# EAGLE design ModSynth_PCB (EAGLE 9.6.2)
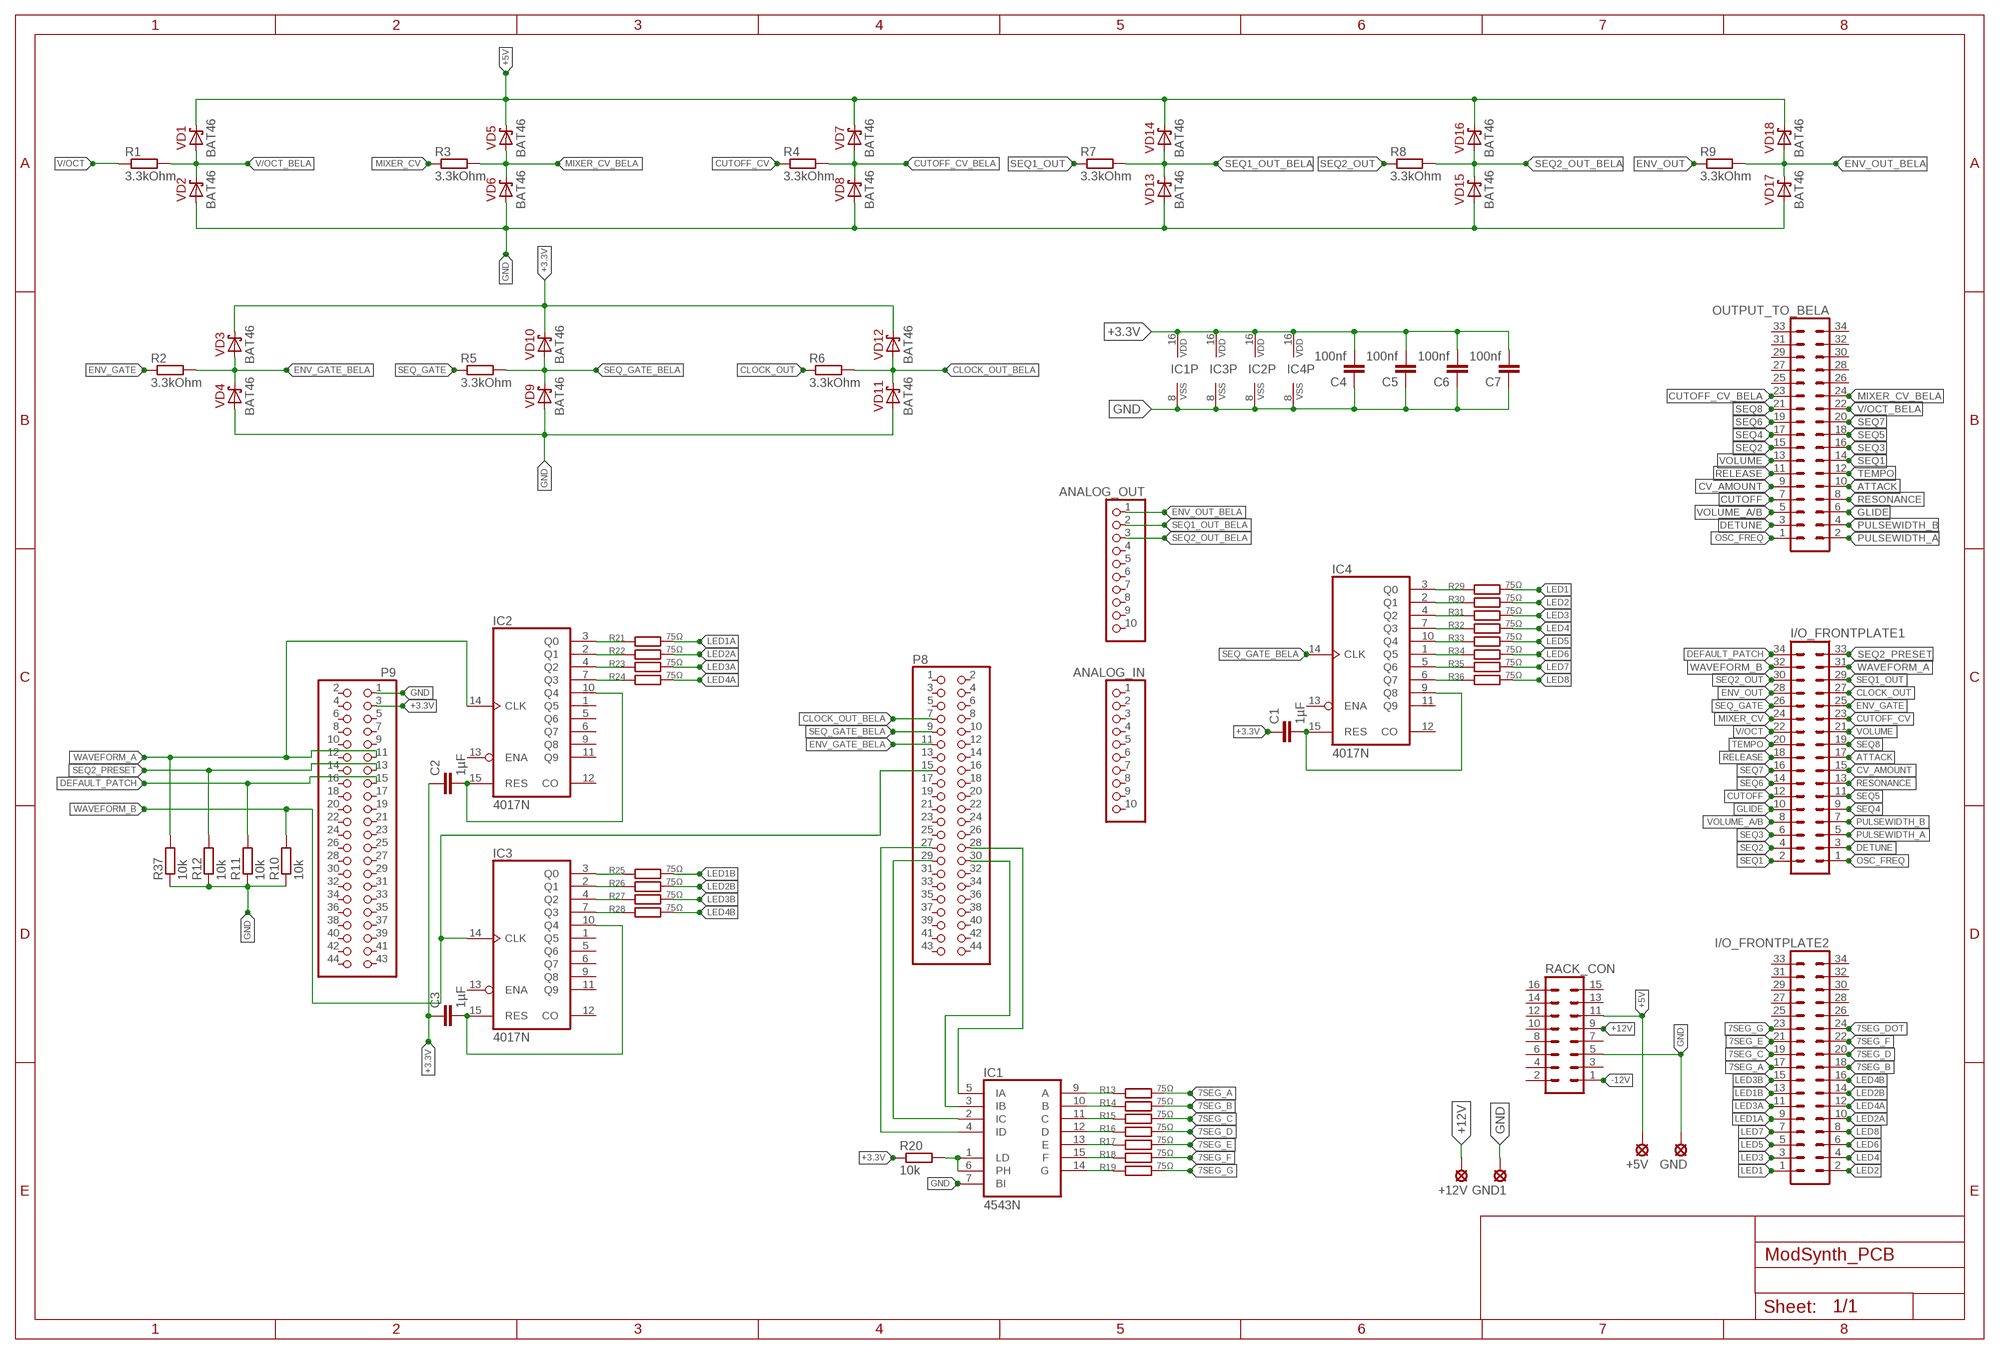
[diagram p0: schematic, sheet 1]

## Parts
+5V  LSP10  [LSP10]
+12V  LSP10  [LSP10]
ANALOG_IN  PINHD-1X10  [1X10]
ANALOG_OUT  PINHD-1X10  [1X10]
C1  1µF  C-EU025-025X050  [C025-025X050]
C2  1µF  C-EU025-025X050  [C025-025X050]
C3  1µF  C-EU025-025X050  [C025-025X050]
C4  100nf  C-EU025-025X050  [C025-025X050]
C5  100nf  C-EU025-025X050  [C025-025X050]
C6  100nf  C-EU025-025X050  [C025-025X050]
C7  100nf  C-EU025-025X050  [C025-025X050]
GND  LSP10  [LSP10]
GND1  LSP10  [LSP10]
I/O_FRONTPLATE1  ML34  [ML34]
I/O_FRONTPLATE2  ML34  [ML34]
IC1  4543N  [DIL16]
IC2  4017N  [DIL16]
IC3  4017N  [DIL16]
IC4  4017N  [DIL16]
OUTPUT_TO_BELA  ML34  [ML34]
P8  PINHD-2X22  [2X22]
P9  PINHD-2X22  [2X22]
R1  3.3kOhm  R-EU_0204/7  [0204/7]
R2  3.3kOhm  R-EU_0204/7  [0204/7]
R3  3.3kOhm  R-EU_0204/7  [0204/7]
R4  3.3kOhm  R-EU_0204/7  [0204/7]
R5  3.3kOhm  R-EU_0204/7  [0204/7]
R6  3.3kOhm  R-EU_0204/7  [0204/7]
R7  3.3kOhm  R-EU_0204/7  [0204/7]
R8  3.3kOhm  R-EU_0204/7  [0204/7]
R9  3.3kOhm  R-EU_0204/7  [0204/7]
R10  10k  R-EU_0204/7  [0204/7]
R11  10k  R-EU_0204/7  [0204/7]
R12  10k  R-EU_0204/7  [0204/7]
R13  75Ω  R-EU_0204/7  [0204/7]
R14  75Ω  R-EU_0204/7  [0204/7]
R15  75Ω  R-EU_0204/7  [0204/7]
R16  75Ω  R-EU_0204/7  [0204/7]
R17  75Ω  R-EU_0204/7  [0204/7]
R18  75Ω  R-EU_0204/7  [0204/7]
R19  75Ω  R-EU_0204/7  [0204/7]
R20  10k  R-EU_0204/7  [0204/7]
R21  75Ω  R-EU_0204/7  [0204/7]
R22  75Ω  R-EU_0204/7  [0204/7]
R23  75Ω  R-EU_0204/7  [0204/7]
R24  75Ω  R-EU_0204/7  [0204/7]
R25  75Ω  R-EU_0204/7  [0204/7]
R26  75Ω  R-EU_0204/7  [0204/7]
R27  75Ω  R-EU_0204/7  [0204/7]
R28  75Ω  R-EU_0204/7  [0204/7]
R29  75Ω  R-EU_0204/7  [0204/7]
R30  75Ω  R-EU_0204/7  [0204/7]
R31  75Ω  R-EU_0204/7  [0204/7]
R32  75Ω  R-EU_0204/7  [0204/7]
R33  75Ω  R-EU_0204/7  [0204/7]
R34  75Ω  R-EU_0204/7  [0204/7]
R35  75Ω  R-EU_0204/7  [0204/7]
R36  75Ω  R-EU_0204/7  [0204/7]
R37  10k  R-EU_0204/7  [0204/7]
RACK_CON  ML16  [ML16]
VD1  BAT46  [DO35-7]
VD2  BAT46  [DO35-7]
VD3  BAT46  [DO35-7]
VD4  BAT46  [DO35-7]
VD5  BAT46  [DO35-7]
VD6  BAT46  [DO35-7]
VD7  BAT46  [DO35-7]
VD8  BAT46  [DO35-7]
VD9  BAT46  [DO35-7]
VD10  BAT46  [DO35-7]
VD11  BAT46  [DO35-7]
VD12  BAT46  [DO35-7]
VD13  BAT46  [DO35-7]
VD14  BAT46  [DO35-7]
VD15  BAT46  [DO35-7]
VD16  BAT46  [DO35-7]
VD17  BAT46  [DO35-7]
VD18  BAT46  [DO35-7]

## Nets
7SEG_A: I/O_FRONTPLATE2.17 R13.2
7SEG_B: I/O_FRONTPLATE2.18 R14.2
7SEG_C: I/O_FRONTPLATE2.19 R15.2
7SEG_D: I/O_FRONTPLATE2.20 R16.2
7SEG_DOT: I/O_FRONTPLATE2.24
7SEG_E: I/O_FRONTPLATE2.21 R17.2
7SEG_F: I/O_FRONTPLATE2.22 R18.2
7SEG_G: I/O_FRONTPLATE2.23 R19.2
+3.3V: C1.1 C2.1 C3.1 C4.2 C5.2 C6.2 C7.2 IC1.16(VDD) IC2.16(VDD) IC3.16(VDD) IC4.16(VDD) P9.3 R20.1 VD3.C VD10.C VD12.C
+5V: +5V.MP RACK_CON.11 VD1.C VD5.C VD7.C VD14.C VD16.C VD18.C
+12V: +12V.MP RACK_CON.9
-12V: RACK_CON.1
ATTACK: I/O_FRONTPLATE1.17 OUTPUT_TO_BELA.10
CLOCK_OUT: I/O_FRONTPLATE1.27 R6.1
CLOCK_OUT_BELA: P8.7 R6.2 VD11.C VD12.A
CUTOFF: I/O_FRONTPLATE1.12 OUTPUT_TO_BELA.7
CUTOFF_CV: I/O_FRONTPLATE1.23 R4.1
CUTOFF_CV_BELA: OUTPUT_TO_BELA.23 R4.2 VD7.A VD8.C
CV_AMOUNT: I/O_FRONTPLATE1.15 OUTPUT_TO_BELA.9
DEFAULT_PATCH: I/O_FRONTPLATE1.34 P9.15 R11.2
DETUNE: I/O_FRONTPLATE1.3 OUTPUT_TO_BELA.3
ENV_GATE: I/O_FRONTPLATE1.25 R2.1
ENV_GATE_BELA: P8.11 R2.2 VD3.A VD4.C
ENV_OUT: I/O_FRONTPLATE1.28 R9.1
ENV_OUT_BELA: ANALOG_OUT.1 R9.2 VD17.C VD18.A
GLIDE: I/O_FRONTPLATE1.10 OUTPUT_TO_BELA.6
GND: C4.1 C5.1 C6.1 C7.1 GND1.MP GND.MP IC1.7(BI) IC1.8(VSS) IC2.8(VSS) IC3.8(VSS) IC4.8(VSS) P9.1 R10.1 R11.1 R12.1 R37.1 RACK_CON.5 VD2.A VD4.A VD6.A VD8.A VD9.A VD11.A VD13.A VD15.A VD17.A
LED1: I/O_FRONTPLATE2.1 R29.2
LED1A: I/O_FRONTPLATE2.9 R21.2
LED1B: I/O_FRONTPLATE2.13 R25.2
LED2: I/O_FRONTPLATE2.2 R30.2
LED2A: I/O_FRONTPLATE2.10 R22.2
LED2B: I/O_FRONTPLATE2.14 R26.2
LED3: I/O_FRONTPLATE2.3 R31.2
LED3A: I/O_FRONTPLATE2.11 R23.2
LED3B: I/O_FRONTPLATE2.15 R27.2
LED4: I/O_FRONTPLATE2.4 R32.2
LED4A: I/O_FRONTPLATE2.12 R24.2
LED4B: I/O_FRONTPLATE2.16 R28.2
LED5: I/O_FRONTPLATE2.5 R33.2
LED6: I/O_FRONTPLATE2.6 R34.2
LED7: I/O_FRONTPLATE2.7 R35.2
LED8: I/O_FRONTPLATE2.8 R36.2
MIXER_CV: I/O_FRONTPLATE1.24 R3.1
MIXER_CV_BELA: OUTPUT_TO_BELA.24 R3.2 VD5.A VD6.C
N$1: IC1.9(A) R13.1
N$2: IC1.10(B) R14.1
N$3: IC1.11(C) R15.1
N$4: IC1.12(D) R16.1
N$5: IC1.13(E) R17.1
N$6: IC1.15(F) R18.1
N$7: IC1.14(G) R19.1
N$8: IC1.1(LD) IC1.6(PH) R20.2
N$15: C2.2 IC2.10(Q4) IC2.15(RES)
N$16: IC2.3(Q0) R21.1
N$17: IC2.2(Q1) R22.1
N$18: IC2.4(Q2) R23.1
N$19: IC2.7(Q3) R24.1
N$24: C3.2 IC3.10(Q4) IC3.15(RES)
N$25: IC3.3(Q0) R25.1
N$26: IC3.2(Q1) R26.1
N$27: IC3.4(Q2) R27.1
N$28: IC3.7(Q3) R28.1
N$33: C1.2 IC4.9(Q8) IC4.15(RES)
N$34: IC4.3(Q0) R29.1
N$35: IC4.2(Q1) R30.1
N$36: IC4.4(Q2) R31.1
N$37: IC4.7(Q3) R32.1
N$39: IC4.10(Q4) R33.1
N$40: IC4.1(Q5) R34.1
N$41: IC4.5(Q6) R35.1
N$42: IC4.6(Q7) R36.1
N$50: IC1.4(ID) P8.27
N$51: IC1.5(IA) P8.28
N$52: IC1.3(IB) P8.30
N$53: IC1.2(IC) P8.29
OSC_FREQ: I/O_FRONTPLATE1.1 OUTPUT_TO_BELA.1
PULSEWIDTH_A: I/O_FRONTPLATE1.5 OUTPUT_TO_BELA.2
PULSEWIDTH_B: I/O_FRONTPLATE1.7 OUTPUT_TO_BELA.4
RELEASE: I/O_FRONTPLATE1.18 OUTPUT_TO_BELA.11
RESONANCE: I/O_FRONTPLATE1.13 OUTPUT_TO_BELA.8
SEQ1: I/O_FRONTPLATE1.2 OUTPUT_TO_BELA.14
SEQ1_OUT: I/O_FRONTPLATE1.29 R7.1
SEQ1_OUT_BELA: ANALOG_OUT.2 R7.2 VD13.C VD14.A
SEQ2: I/O_FRONTPLATE1.4 OUTPUT_TO_BELA.15
SEQ2_OUT: I/O_FRONTPLATE1.30 R8.1
SEQ2_OUT_BELA: ANALOG_OUT.3 R8.2 VD15.C VD16.A
SEQ2_PRESET: I/O_FRONTPLATE1.33 P9.13 R12.2
SEQ3: I/O_FRONTPLATE1.6 OUTPUT_TO_BELA.16
SEQ4: I/O_FRONTPLATE1.9 OUTPUT_TO_BELA.17
SEQ5: I/O_FRONTPLATE1.11 OUTPUT_TO_BELA.18
SEQ6: I/O_FRONTPLATE1.14 OUTPUT_TO_BELA.19
SEQ7: I/O_FRONTPLATE1.16 OUTPUT_TO_BELA.20
SEQ8: I/O_FRONTPLATE1.19 OUTPUT_TO_BELA.21
SEQ_GATE: I/O_FRONTPLATE1.26 R5.1
SEQ_GATE_BELA: IC4.14(CLK) P8.9 R5.2 VD9.C VD10.A
TEMPO: I/O_FRONTPLATE1.20 OUTPUT_TO_BELA.12
V/OCT: I/O_FRONTPLATE1.22 R1.1
V/OCT_BELA: OUTPUT_TO_BELA.22 R1.2 VD1.A VD2.C
VOLUME: I/O_FRONTPLATE1.21 OUTPUT_TO_BELA.13
VOLUME_A/B: I/O_FRONTPLATE1.8 OUTPUT_TO_BELA.5
WAVEFORM_A: I/O_FRONTPLATE1.31 IC2.14(CLK) P9.11 R37.2
WAVEFORM_B: I/O_FRONTPLATE1.32 IC3.14(CLK) P8.15 R10.2
Unconnected: ANALOG_IN.1 ANALOG_IN.2 ANALOG_IN.3 ANALOG_IN.4 ANALOG_IN.5 ANALOG_IN.6 ANALOG_IN.7 ANALOG_IN.8 ANALOG_IN.9 ANALOG_IN.10 ANALOG_OUT.4 ANALOG_OUT.5 ANALOG_OUT.6 ANALOG_OUT.7 ANALOG_OUT.8 ANALOG_OUT.9 ANALOG_OUT.10 I/O_FRONTPLATE2.25 I/O_FRONTPLATE2.26 I/O_FRONTPLATE2.27 I/O_FRONTPLATE2.28 I/O_FRONTPLATE2.29 I/O_FRONTPLATE2.30 I/O_FRONTPLATE2.31 I/O_FRONTPLATE2.32 I/O_FRONTPLATE2.33 I/O_FRONTPLATE2.34 IC2.1(Q5) IC2.5(Q6) IC2.6(Q7) IC2.9(Q8) IC2.11(Q9) IC2.12(CO) IC2.13(ENA) IC3.1(Q5) IC3.5(Q6) IC3.6(Q7) IC3.9(Q8) IC3.11(Q9) IC3.12(CO) IC3.13(ENA) IC4.11(Q9) IC4.12(CO) IC4.13(ENA) OUTPUT_TO_BELA.25 OUTPUT_TO_BELA.26 OUTPUT_TO_BELA.27 OUTPUT_TO_BELA.28 OUTPUT_TO_BELA.29 OUTPUT_TO_BELA.30 OUTPUT_TO_BELA.31 OUTPUT_TO_BELA.32 OUTPUT_TO_BELA.33 OUTPUT_TO_BELA.34 P8.1 P8.2 P8.3 P8.4 P8.5 P8.6 P8.8 P8.10 P8.12 P8.13 P8.14 P8.16 P8.17 P8.18 P8.19 P8.20 P8.21 P8.22 P8.23 P8.24 P8.25 P8.26 P8.31 P8.32 P8.33 P8.34 P8.35 P8.36 P8.37 P8.38 P8.39 P8.40 P8.41 P8.42 P8.43 P8.44 P9.2 P9.4 P9.5 P9.6 P9.7 P9.8 P9.9 P9.10 P9.12 P9.14 P9.16 P9.17 P9.18 P9.19 P9.20 P9.21 P9.22 P9.23 P9.24 P9.25 P9.26 P9.27 P9.28 P9.29 P9.30 P9.31 P9.32 P9.33 P9.34 P9.35 P9.36 P9.37 P9.38 P9.39 P9.40 P9.41 P9.42 P9.43 P9.44 RACK_CON.2 RACK_CON.3 RACK_CON.4 RACK_CON.6 RACK_CON.7 RACK_CON.8 RACK_CON.10 RACK_CON.12 RACK_CON.13 RACK_CON.14 RACK_CON.15 RACK_CON.16

## Library data of the parts
+5V +12V GND GND1 = solpad:LSP10: SOLDER PAD drill 1.0 mm, distributor Buerklin, 12H555
ANALOG_IN ANALOG_OUT = pinhead:PINHD-1X10: PIN HEADER
C1-C7 = rcl:C-EU: CAPACITOR, European symbol; SPICEPREFIX: C
I/O_FRONTPLATE1 I/O_FRONTPLATE2 OUTPUT_TO_BELA = con-harting-ml:ML34: HARTING; OC_FARNELL: unknown; OC_NEWARK: unknown
IC1 = 45xx:4543: BCD to 7-segment LCD DECODER
IC2-IC4 = 40xx:4017: COUNTER/DIVIDER
P8 P9 = pinhead:PINHD-2X22: PIN HEADER
R1-R37 = rcl:R-EU_: RESISTOR, European symbol; SPICEPREFIX: R
RACK_CON = con-harting-ml:ML16: HARTING; OC_FARNELL: unknown; OC_NEWARK: unknown
VD1-VD18 = diodes-schottky:?; MOUSER: 511-BAT46

## Board
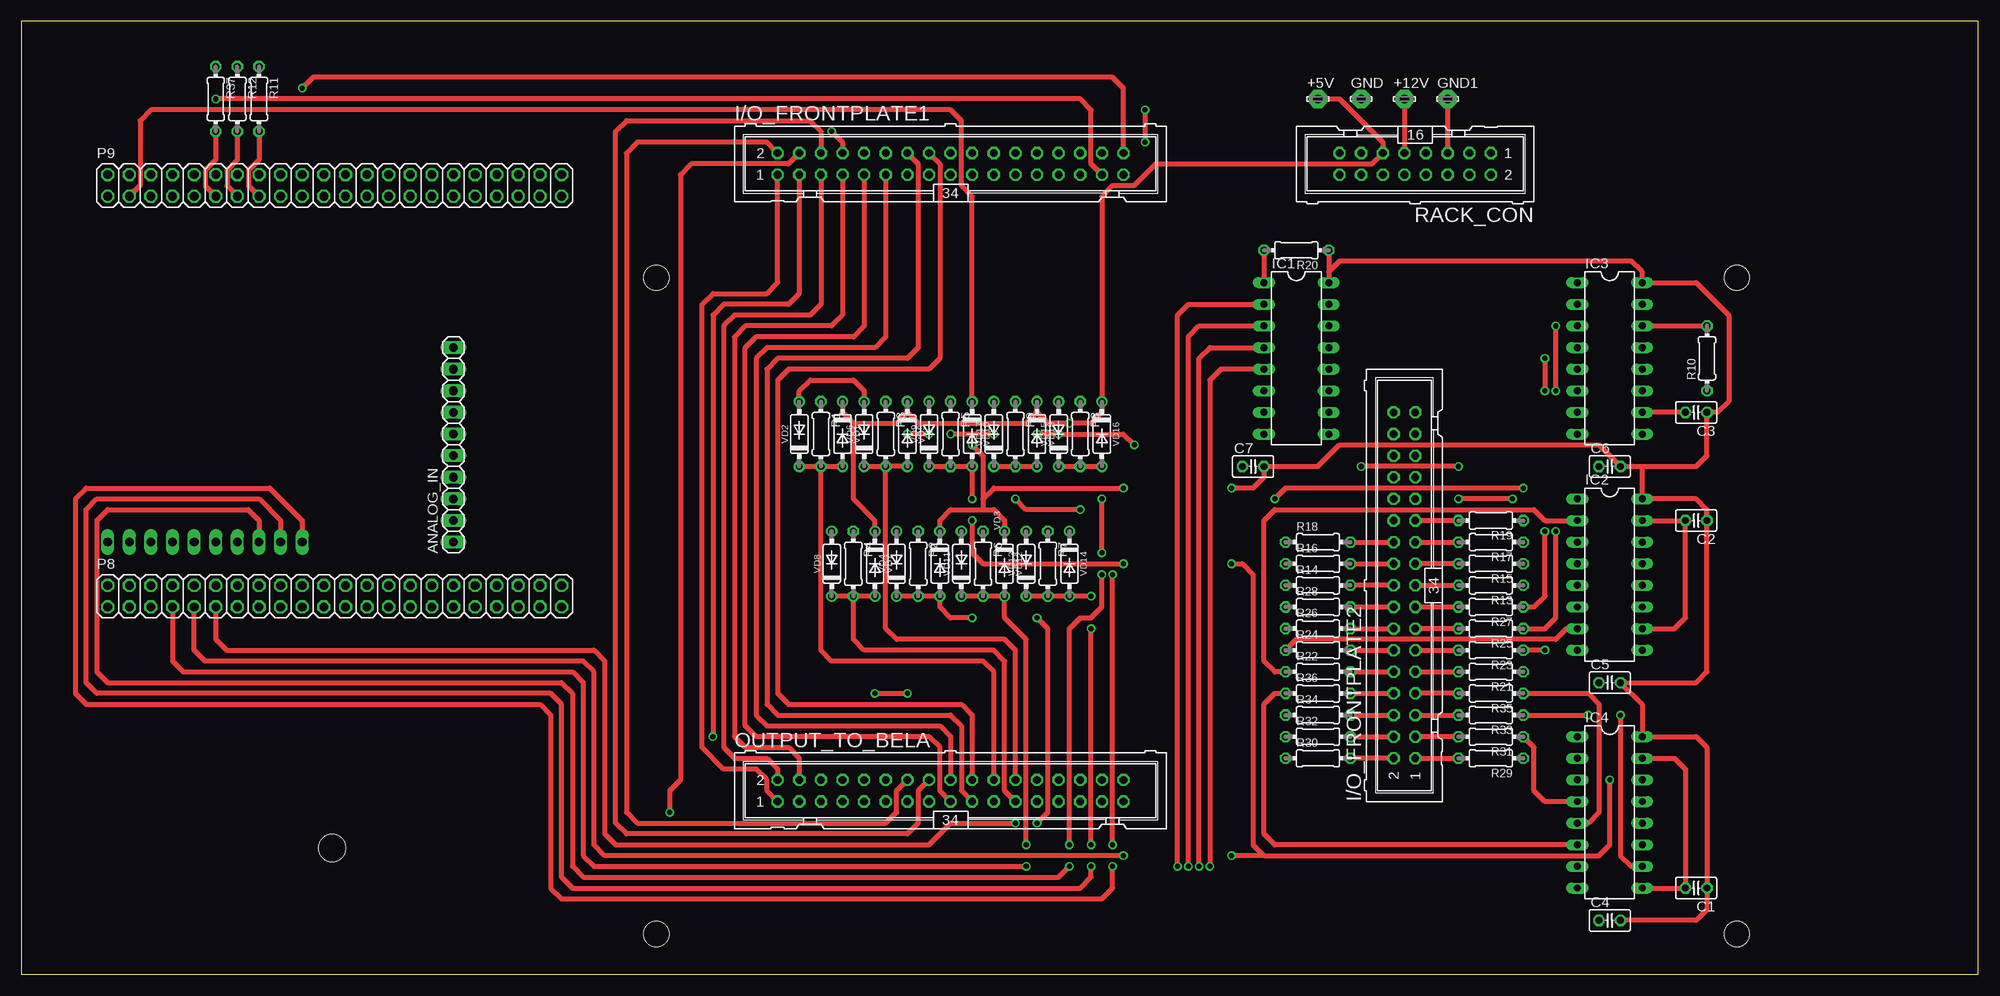
[diagram p1: board, top side]
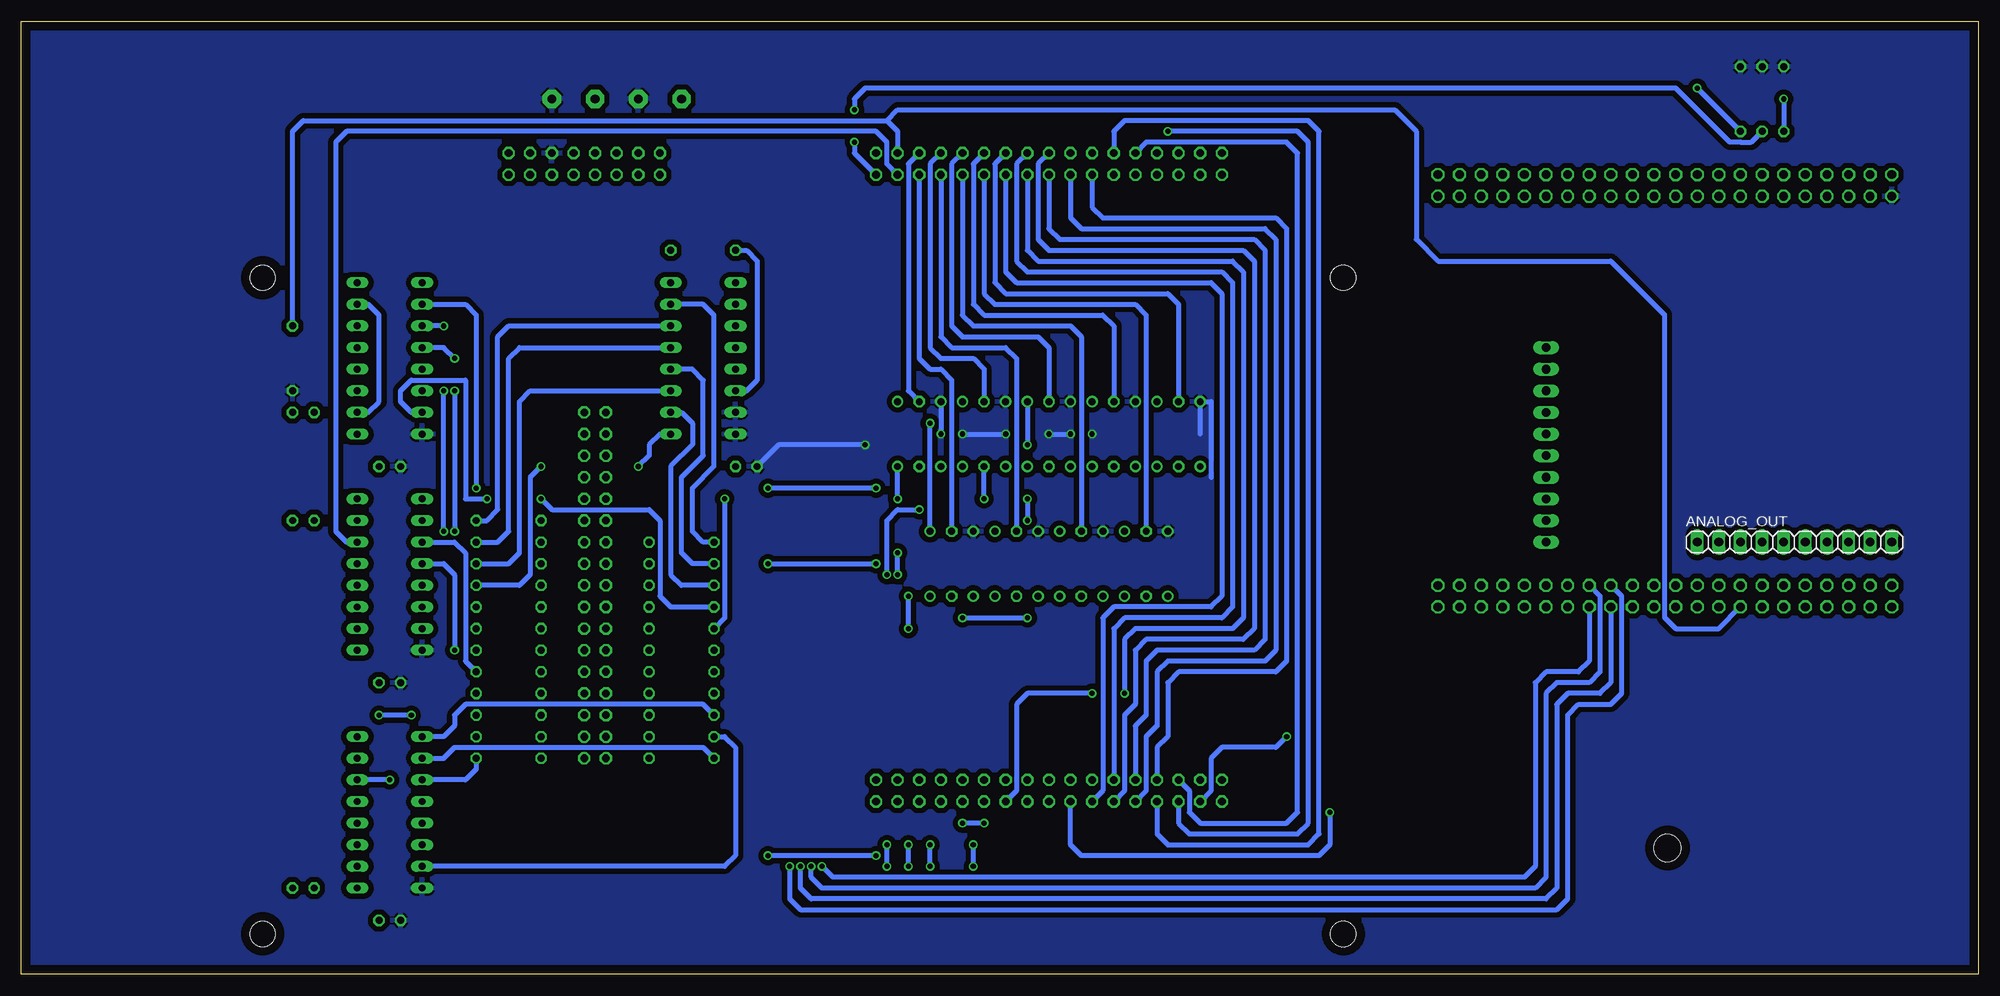
[diagram p2: board, bottom side, seen from below]

Size 230 x 112 mm. Coordinates in mm from the lower left corner, seen from the top.
Outline: 0,0 230,0 230,112 0,112 0,0
Copper layers (1*16): Top 0.035mm / dielectric 1.5mm / Bottom 0.035mm
Design rules "default": minimum track width 6mil, minimum drill 0.35mm, track to track 6mil, track to pad 6mil, pad to pad 6mil, via to via 6mil, smd to smd 6mil, copper to edge 40mil, drill to drill 6mil, minimum pad ring 10mil, minimum via ring 8mil, stop-mask expansion 4mil, vias tented up to drill 0mil, thermal gap 10mil
Holes 3 mm at 74.62,81.87 201.62,81.87 74.62,4.77 201.62,4.77
Holes 3.2 mm at 36.52,14.86

### Footprints (pad centres in the part's own frame; a part is rotated, then mirrored left to right if it is on the bottom)
LSP10 = drill 1.016 pad 2.159 octagon: MP 0,0
1X10 = drill 1.016 long: 1 -11.43,0; 2 -8.89,0; 3 -6.35,0; 4 -3.81,0; 5 -1.27,0; 6 1.27,0; 7 3.81,0; 8 6.35,0; 9 8.89,0; 10 11.43,0
C025-025X050 = drill 0.813 octagon: 1 -1.27,0; 2 1.27,0
ML34 = drill 0.914 octagon: 1 -20.32,-1.27; 2 -20.32,1.27; 3 -17.78,-1.27; 4 -17.78,1.27; 5 -15.24,-1.27; 6 -15.24,1.27; 7 -12.7,-1.27; 8 -12.7,1.27; 9 -10.16,-1.27; 10 -10.16,1.27; 11 -7.62,-1.27; 12 -7.62,1.27; 13 -5.08,-1.27; 14 -5.08,1.27; 15 -2.54,-1.27; 16 -2.54,1.27; 17 0,-1.27; 18 0,1.27; 19 2.54,-1.27; 20 2.54,1.27; 21 5.08,-1.27; 22 5.08,1.27; 23 7.62,-1.27; 24 7.62,1.27; 25 10.16,-1.27; 26 10.16,1.27; 27 12.7,-1.27; 28 12.7,1.27; 29 15.24,-1.27; 30 15.24,1.27; 31 17.78,-1.27; 32 17.78,1.27; 33 20.32,-1.27; 34 20.32,1.27
DIL16 = drill 0.813 long: 1 -8.89,-3.81; 2 -6.35,-3.81; 3 -3.81,-3.81; 4 -1.27,-3.81; 5 1.27,-3.81; 6 3.81,-3.81; 7 6.35,-3.81; 8 8.89,-3.81; 9 8.89,3.81; 10 6.35,3.81; 11 3.81,3.81; 12 1.27,3.81; 13 -1.27,3.81; 14 -3.81,3.81; 15 -6.35,3.81; 16 -8.89,3.81
2X22 = drill 1.016 octagon: 1 -25.4,-1.27; 2 -25.4,1.27; 3 -22.86,-1.27; 4 -22.86,1.27; 5 -20.32,-1.27; 6 -20.32,1.27; 7 -17.78,-1.27; 8 -17.78,1.27; 9 -15.24,-1.27; 10 -15.24,1.27; 11 -12.7,-1.27; 12 -12.7,1.27; 13 -10.16,-1.27; 14 -10.16,1.27; 15 -7.62,-1.27; 16 -7.62,1.27; 17 -5.08,-1.27; 18 -5.08,1.27; 19 -2.54,-1.27; 20 -2.54,1.27; 21 0,-1.27; 22 0,1.27; 23 2.54,-1.27; 24 2.54,1.27; 25 5.08,-1.27; 26 5.08,1.27; 27 7.62,-1.27; 28 7.62,1.27; 29 10.16,-1.27; 30 10.16,1.27; 31 12.7,-1.27; 32 12.7,1.27; 33 15.24,-1.27; 34 15.24,1.27; 35 17.78,-1.27; 36 17.78,1.27; 37 20.32,-1.27; 38 20.32,1.27; 39 22.86,-1.27; 40 22.86,1.27; 41 25.4,-1.27; 42 25.4,1.27; 43 27.94,-1.27; 44 27.94,1.27
0204/7 = drill 0.813 octagon: 1 -3.81,0; 2 3.81,0
ML16 = drill 0.914 octagon: 1 -8.89,-1.27; 2 -8.89,1.27; 3 -6.35,-1.27; 4 -6.35,1.27; 5 -3.81,-1.27; 6 -3.81,1.27; 7 -1.27,-1.27; 8 -1.27,1.27; 9 1.27,-1.27; 10 1.27,1.27; 11 3.81,-1.27; 12 3.81,1.27; 13 6.35,-1.27; 14 6.35,1.27; 15 8.89,-1.27; 16 8.89,1.27
DO35-7 = drill 0.813: A 3.81,0; C -3.81,0

### Placement (x,y rotation side)
+5V  152.4,102.87 0 top
+12V  162.56,102.87 0 top
ANALOG_IN  50.8,62.23 90 top
ANALOG_OUT  21.59,50.8 0 bottom
C1  196.85,10.16 180 top
C2  196.85,53.34 180 top
C3  196.85,66.04 180 top
C4  186.69,6.35 0 top
C5  186.69,34.29 0 top
C6  186.69,59.69 0 top
C7  144.78,59.69 0 top
GND  157.48,102.87 0 top
GND1  167.64,102.87 0 top
I/O_FRONTPLATE1  109.22,95.25 0 top
I/O_FRONTPLATE2  162.56,45.72 90 top
IC1  149.86,72.39 270 top
IC2  186.69,46.99 270 top
IC3  186.69,72.39 270 top
IC4  186.69,19.05 270 top
OUTPUT_TO_BELA  109.22,21.59 0 top
P8  35.56,44.45 0 top
P9  35.56,92.71 0 top
R1  93.98,63.5 270 top
R2  105.41,48.26 270 top
R3  101.6,63.5 270 top
R4  97.79,48.26 270 top
R5  109.22,63.5 270 top
R6  113.03,48.26 270 top
R7  120.65,48.26 270 top
R8  124.46,63.5 270 top
R9  116.84,63.5 270 top
R10  198.12,72.39 90 top
R11  27.94,102.87 270 top
R12  25.4,102.87 270 top
R13  172.72,45.72 180 top
R14  152.4,45.72 0 top
R15  172.72,48.26 180 top
R16  152.4,48.26 0 top
R17  172.72,50.8 180 top
R18  152.4,50.8 0 top
R19  172.72,53.34 180 top
R20  149.86,85.09 180 top
R21  172.72,35.56 180 top
R22  152.4,35.56 0 top
R23  172.72,38.1 180 top
R24  152.4,38.1 0 top
R25  172.72,40.64 180 top
R26  152.4,40.64 0 top
R27  172.72,43.18 180 top
R28  152.4,43.18 0 top
R29  172.72,25.4 180 top
R30  152.4,25.4 0 top
R31  172.72,27.94 180 top
R32  152.4,27.94 0 top
R33  172.72,30.48 180 top
R34  152.4,30.48 0 top
R35  172.72,33.02 180 top
R36  152.4,33.02 0 top
R37  22.86,102.87 270 top
RACK_CON  163.83,95.25 180 top
VD1  96.52,63.5 270 top
VD2  91.44,63.5 90 top
VD3  107.95,48.26 270 top
VD4  102.87,48.26 90 top
VD5  104.14,63.5 270 top
VD6  99.06,63.5 90 top
VD7  100.33,48.26 270 top
VD8  95.25,48.26 90 top
VD9  106.68,63.5 90 top
VD10  111.76,63.5 270 top
VD11  110.49,48.26 90 top
VD12  115.57,48.26 270 top
VD13  118.11,48.26 90 top
VD14  123.19,48.26 270 top
VD15  121.92,63.5 90 top
VD16  127,63.5 270 top
VD17  114.3,63.5 90 top
VD18  119.38,63.5 270 top

### Tracks (layer width: path | path; a pad name or v marks a point on that pad's centre or on a via)
7SEG_A
  Top 0.61: I/O_FRONTPLATE2.17 R13.2
7SEG_B
  Top 0.61: I/O_FRONTPLATE2.18 R14.2
7SEG_C
  Top 0.61: R15.2 I/O_FRONTPLATE2.19
7SEG_D
  Top 0.61: R16.2 I/O_FRONTPLATE2.20
7SEG_E
  Top 0.61: I/O_FRONTPLATE2.21 R17.2
7SEG_F
  Top 0.61: R18.2 I/O_FRONTPLATE2.22
7SEG_G
  Top 0.61: R19.2 I/O_FRONTPLATE2.23
+3.3V  (via drill 0.6)
  Top 0.61: VD3.C 107.95,53.34 109.22,54.61 113.03,54.61 | 113.03,54.61 114.3,54.61 115.57,53.34 VD12.C | 190.5,59.69 C6.2 185.42,62.23 154.94,62.23 152.4,59.69 C7.2 146.05,58.42 144.78,57.15 v142.24,57.15 | 190.5,59.69 196.85,59.69 198.12,60.96 C3.1 199.39,66.04 200.66,67.31 200.66,77.47 196.85,81.28 IC3.16 190.5,82.55 189.23,83.82 154.94,83.82 153.67,82.55 IC1.16 R20.1 | 190.5,59.69 IC2.16 196.85,55.88 198.12,54.61 C2.1 198.12,35.56 196.85,34.29 C5.2 190.5,31.75 IC4.16 196.85,27.94 198.12,26.67 C1.1 198.12,7.62 196.85,6.35 C4.2 | v111.76,62.23 113.03,60.96 113.03,55.88 | 113.03,55.88 113.03,54.61 | 113.03,55.88 114.3,57.15 v129.54,57.15 | VD10.C 111.76,91.44 110.49,92.71 110.49,100.33 109.22,101.6 15.24,101.6 13.97,100.33 13.97,92.71 P9.3
  Bottom 0.61: VD10.C v111.76,62.23 | v129.54,57.15 v142.24,57.15
+5V  (via drill 0.6)
  Top 0.61: VD1.C 96.52,66.04 97.79,64.77 | 97.79,64.77 102.87,64.77 104.14,66.04 | 104.14,66.04 VD5.C | 104.14,66.04 105.41,64.77 118.11,64.77 119.38,66.04 | 119.38,66.04 VD18.C | 119.38,66.04 120.65,64.77 v123.19,64.77 125.73,64.77 127,66.04 VD16.C 127,91.44 128.27,92.71 130.81,92.71 133.35,95.25 158.75,95.25 RACK_CON.11 160.02,97.79 154.94,102.87 +5V.MP | VD7.C 100.33,53.34 97.79,55.88 97.79,64.77
  Bottom 0.61: VD14.C v123.19,64.77
+12V
  Top 0.61: +12V.MP RACK_CON.9
ATTACK
  Bottom 0.61: I/O_FRONTPLATE1.17 109.22,87.63 107.95,86.36 85.09,86.36 83.82,85.09 83.82,39.37 85.09,38.1 96.52,38.1 97.79,36.83 97.79,30.48 99.06,29.21 OUTPUT_TO_BELA.10
CLOCK_OUT
  Bottom 0.61: I/O_FRONTPLATE1.27 121.92,74.93 120.65,73.66 114.3,73.66 113.03,72.39 R6.1
CLOCK_OUT_BELA  (via drill 0.6)
  Top 0.61: VD11.C R6.2 VD12.A 115.57,41.91 118.11,39.37 v118.11,15.24 | P8.7 17.78,36.83 19.05,35.56 64.77,35.56 66.04,34.29 66.04,13.97 67.31,12.7 v118.11,12.7
  Bottom 0.61: v118.11,12.7 v118.11,15.24
CUTOFF
  Bottom 0.61: OUTPUT_TO_BELA.7 96.52,16.51 95.25,15.24 78.74,15.24 77.47,16.51 77.47,99.06 78.74,100.33 100.33,100.33 101.6,99.06 I/O_FRONTPLATE1.12
CUTOFF_CV
  Bottom 0.61: R4.1 97.79,77.47 99.06,78.74 115.57,78.74 116.84,80.01 I/O_FRONTPLATE1.23
CUTOFF_CV_BELA
  Top 0.61: VD7.A R4.2 | R4.2 VD8.C | OUTPUT_TO_BELA.23 115.57,21.59 115.57,36.83 114.3,38.1 99.06,38.1 97.79,39.37 R4.2
CV_AMOUNT
  Bottom 0.61: I/O_FRONTPLATE1.15 106.68,88.9 105.41,87.63 83.82,87.63 82.55,86.36 82.55,38.1 83.82,36.83 95.25,36.83 96.52,35.56 96.52,29.21 97.79,27.94 97.79,21.59 OUTPUT_TO_BELA.9
DEFAULT_PATCH  (via drill 0.6)
  Top 0.61: I/O_FRONTPLATE1.34 129.54,104.14 128.27,105.41 34.29,105.41 v33.02,104.14 | R11.2 27.94,95.7 26.72,94.48 26.72,92.66 P9.15
  Bottom 0.61: v33.02,104.14 R11.2
DETUNE  (via drill 0.6)
  Top 0.61: I/O_FRONTPLATE1.3 91.44,80.01 90.17,78.74 82.55,78.74 81.28,77.47 v81.28,27.94
  Bottom 0.61: v81.28,27.94 82.55,26.67 88.9,26.67 90.17,25.4 90.17,21.59 OUTPUT_TO_BELA.3
ENV_GATE
  Bottom 0.61: R2.1 105.41,74.93 106.68,76.2 118.11,76.2 119.38,77.47 I/O_FRONTPLATE1.25
ENV_GATE_BELA  (via drill 0.6)
  Top 0.61: VD4.C R2.2 VD3.A 107.95,43.18 109.22,41.91 v111.76,41.91 | P8.11 22.86,39.37 24.13,38.1 67.31,38.1 68.58,36.83 68.58,16.51 69.85,15.24 106.68,15.24 109.22,17.78 v116.84,17.78 | v119.38,17.78 120.65,19.05 120.65,40.64 v119.38,41.91
  Bottom 0.61: v116.84,17.78 v119.38,17.78 | v119.38,41.91 v111.76,41.91
ENV_OUT
  Bottom 0.61: I/O_FRONTPLATE1.28 123.19,95.25 123.19,73.66 121.92,72.39 118.11,72.39 116.84,71.12 R9.1
ENV_OUT_BELA  (via drill 0.6)
  Top 0.61: VD17.C R9.2 VD18.A | v124.46,54.61 118.11,54.61 v116.84,55.88 | v128.27,12.7 128.27,10.16 127,8.89 63.5,8.89 62.23,10.16 62.23,30.48 60.96,31.75 7.62,31.75 6.35,33.02 6.35,55.88 7.62,57.15 29.21,57.15 33.02,53.34 ANALOG_OUT.1 | v128.27,15.24 v128.27,46.99
  Bottom 0.61: v116.84,55.88 R9.2 | v128.27,12.7 v128.27,15.24 | v128.27,46.99 128.27,53.34 127,54.61 v124.46,54.61
GLIDE
  Bottom 0.61: OUTPUT_TO_BELA.6 92.71,21.59 92.71,19.05 91.44,17.78 81.28,17.78 80.01,19.05 80.01,96.52 81.28,97.79 97.79,97.79 I/O_FRONTPLATE1.10
GND  (via drill 0.6)
  Top 0.61: v119.38,63.5 v121.92,63.5 129.54,63.5 v130.81,62.23 | v114.3,63.5 v109.22,63.5 | v106.68,63.5 v104.14,63.5 | VD2.A 91.44,68.58 92.71,69.85 97.79,69.85 99.06,68.58 VD6.A | GND1.MP RACK_CON.5
  Bottom 0.61: VD15.A v121.92,63.5 | v119.38,63.5 v114.3,63.5 | v109.22,63.5 v106.68,63.5 | 91.44,63.5 VD2.A 90.17,67.31 90.17,58.42 | v130.81,62.23 140.97,62.23 C7.1
  pour Bottom (isolate 0.61): 0,111.76 0,0 228.6,0 228.6,111.76
LED1
  Top 0.61: I/O_FRONTPLATE2.1 R29.2
LED1A
  Top 0.61: I/O_FRONTPLATE2.9 R21.2
LED1B
  Top 0.61: R25.2 I/O_FRONTPLATE2.13
LED2
  Top 0.61: I/O_FRONTPLATE2.2 R30.2
LED2A
  Top 0.61: R22.2 I/O_FRONTPLATE2.10
LED2B
  Top 0.61: R26.2 I/O_FRONTPLATE2.14
LED3
  Top 0.61: R31.2 I/O_FRONTPLATE2.3
LED3A
  Top 0.61: I/O_FRONTPLATE2.11 R23.2
LED3B
  Top 0.61: I/O_FRONTPLATE2.15 R27.2
LED4
  Top 0.61: R32.2 I/O_FRONTPLATE2.4
LED4A
  Top 0.61: R24.2 I/O_FRONTPLATE2.12
LED4B
  Top 0.61: R28.2 I/O_FRONTPLATE2.16
LED5
  Top 0.61: I/O_FRONTPLATE2.5 R33.2
LED6
  Top 0.61: R34.2 I/O_FRONTPLATE2.6
LED7
  Top 0.61: R35.2 I/O_FRONTPLATE2.7
LED8
  Top 0.61: R36.2 I/O_FRONTPLATE2.8
MIXER_CV
  Bottom 0.61: I/O_FRONTPLATE1.24 118.11,95.25 118.11,78.74 116.84,77.47 102.87,77.47 101.6,76.2 R3.1
MIXER_CV_BELA
  Top 0.61: VD6.C R3.2 | VD5.A R3.2 | OUTPUT_TO_BELA.24 116.84,38.1 115.57,39.37 102.87,39.37 101.6,40.64 R3.2
N$1  (via drill 0.6)
  Top 0.61: v168.91,59.69 v157.48,59.69
  Bottom 0.61: v168.91,59.69 170.18,58.42 170.18,46.99 171.45,45.72 R13.1 | IC1.9 154.94,63.5 156.21,62.23 156.21,60.96 v157.48,59.69
N$2
  Bottom 0.61: R14.1 152.4,45.72 153.67,46.99 153.67,59.69 151.13,62.23 151.13,64.77 152.4,66.04 IC1.10
N$3
  Bottom 0.61: R15.1 172.72,48.26 171.45,49.53 171.45,67.31 170.18,68.58 IC1.11
N$4
  Bottom 0.61: R16.1 151.13,48.26 152.4,49.53 152.4,58.42 149.86,60.96 149.86,69.85 151.13,71.12 IC1.12
N$5
  Bottom 0.61: R17.1 173.99,50.8 172.72,52.07 172.72,72.39 171.45,73.66 IC1.13
N$6
  Bottom 0.61: R18.1 149.86,50.8 151.13,52.07 151.13,57.15 148.59,59.69 148.59,77.47 149.86,78.74 IC1.15
N$7
  Bottom 0.61: R19.1 175.26,53.34 173.99,54.61 173.99,74.93 172.72,76.2 IC1.14
N$8
  Top 0.61: R20.2 IC1.1
  Bottom 0.61: R20.2 144.78,85.09 143.51,83.82 143.51,69.85 144.78,68.58 IC1.6
N$15
  Top 0.61: IC2.15 C2.2 195.58,41.91 194.31,40.64 IC2.10
N$16
  Bottom 0.61: IC2.3 179.07,50.8 177.8,49.53 177.8,36.83 R21.1
N$17
  Top 0.61: R22.1 147.32,35.56 146.05,36.83 146.05,53.34 147.32,54.61 177.8,54.61 179.07,53.34 IC2.2
N$18  (via drill 0.6)
  Top 0.61: v179.07,38.1 R23.1
  Bottom 0.61: IC2.4 180.34,48.26 179.07,46.99 v179.07,38.1
N$19
  Top 0.61: IC2.7 181.61,40.64 180.34,39.37 149.86,39.37 R24.1
N$24
  Top 0.61: C3.2 IC3.10
  Bottom 0.61: IC3.10 189.23,66.04 187.96,67.31 187.96,77.47 189.23,78.74 IC3.15
N$25  (via drill 0.6)
  Top 0.61: R25.1 179.07,40.64 180.34,41.91 v180.34,52.07 | v180.34,68.58 v180.34,76.2
  Bottom 0.61: v180.34,52.07 v180.34,68.58 | v180.34,76.2 IC3.3
N$26  (via drill 0.6)
  Top 0.61: v176.53,57.15 148.59,57.15 v147.32,55.88
  Bottom 0.61: IC3.2 177.8,78.74 176.53,77.47 v176.53,57.15 | v147.32,55.88 147.32,41.91 R26.1
N$27  (via drill 0.6)
  Top 0.61: R27.1 177.8,43.18 179.07,44.45 v179.07,52.07 | v179.07,72.39 v179.07,68.58
  Bottom 0.61: v179.07,72.39 180.34,73.66 IC3.4 | v179.07,68.58 v179.07,52.07
N$28  (via drill 0.6)
  Top 0.61: v175.26,55.88 v168.91,55.88
  Bottom 0.61: IC3.7 184.15,66.04 185.42,67.31 185.42,68.58 184.15,69.85 177.8,69.85 177.8,55.88 v175.26,55.88 | v168.91,55.88 167.64,54.61 156.21,54.61 154.94,53.34 154.94,44.45 153.67,43.18 R28.1
N$33
  Top 0.61: IC4.9 C1.2 195.58,24.13 194.31,25.4 IC4.15
N$34
  Bottom 0.61: R29.1 176.53,24.13 177.8,22.86 IC4.3
N$35
  Bottom 0.61: IC4.2 180.34,25.4 179.07,26.67 149.86,26.67 R30.1
N$36
  Top 0.61: IC4.4 179.07,20.32 177.8,21.59 177.8,26.67 R31.1
N$37
  Bottom 0.61: R32.1 147.32,27.94 146.05,26.67 146.05,13.97 147.32,12.7 IC4.7
N$39  (via drill 0.6)
  Top 0.61: R33.1 v184.15,30.48 | v187.96,30.48 187.96,13.97 189.23,12.7 IC4.10
  Bottom 0.61: v184.15,30.48 v187.96,30.48
N$40
  Bottom 0.61: R34.1 149.86,31.75 177.8,31.75 179.07,30.48 179.07,29.21 180.34,27.94 IC4.1
N$41
  Top 0.61: IC4.5 184.15,17.78 185.42,19.05 185.42,31.75 184.15,33.02 R35.1
N$42
  Top 0.61: IC4.6 147.32,15.24 146.05,16.51 146.05,31.75 147.32,33.02 R36.1
N$50  (via drill 0.6)
  Top 0.61: v138.43,12.7 138.43,72.39 139.7,73.66 IC1.4
  Bottom 0.61: P8.27 43.18,34.29 44.45,33.02 48.26,33.02 49.53,31.75 49.53,10.16 50.8,8.89 137.16,8.89 138.43,10.16 v138.43,12.7
N$51  (via drill 0.6)
  Top 0.61: IC1.5 140.97,71.12 139.7,69.85 v139.7,12.7
  Bottom 0.61: v139.7,12.7 139.7,8.89 138.43,7.62 49.53,7.62 48.26,8.89 48.26,30.48 46.99,31.75 43.18,31.75 41.91,33.02 41.91,44.45 P8.28
N$52  (via drill 0.6)
  Top 0.61: v137.16,12.7 137.16,74.93 138.43,76.2 IC1.3
  Bottom 0.61: P8.30 44.45,44.45 44.45,35.56 45.72,34.29 49.53,34.29 50.8,33.02 50.8,11.43 52.07,10.16 135.89,10.16 137.16,11.43 v137.16,12.7
N$53  (via drill 0.6)
  Top 0.61: v135.89,12.7 135.89,77.47 137.16,78.74 IC1.2
  Bottom 0.61: P8.29 45.72,36.83 46.99,35.56 50.8,35.56 52.07,34.29 52.07,12.7 53.34,11.43 134.62,11.43 v135.89,12.7
OSC_FREQ
  Top 0.61: OUTPUT_TO_BELA.1 87.63,21.59 87.63,22.86 86.36,24.13 82.55,24.13 80.01,26.67 80.01,78.74 81.28,80.01 87.63,80.01 88.9,81.28 I/O_FRONTPLATE1.1
PULSEWIDTH_A
  Top 0.61: I/O_FRONTPLATE1.5 93.98,78.74 92.71,77.47 83.82,77.47 82.55,76.2 82.55,26.67 83.82,25.4 87.63,25.4 88.9,24.13 OUTPUT_TO_BELA.2
PULSEWIDTH_B
  Top 0.61: I/O_FRONTPLATE1.7 96.52,77.47 95.25,76.2 85.09,76.2 83.82,74.93 83.82,27.94 85.09,26.67 90.17,26.67 91.44,25.4 OUTPUT_TO_BELA.4
RELEASE
  Bottom 0.61: I/O_FRONTPLATE1.18 110.49,95.25 110.49,86.36 109.22,85.09 86.36,85.09 85.09,83.82 85.09,40.64 86.36,39.37 97.79,39.37 99.06,38.1 99.06,31.75 100.33,30.48 100.33,21.59 OUTPUT_TO_BELA.11
RESONANCE
  Bottom 0.61: I/O_FRONTPLATE1.13 104.14,90.17 102.87,88.9 82.55,88.9 81.28,87.63 81.28,36.83 82.55,35.56 93.98,35.56 95.25,34.29 95.25,27.94 96.52,26.67 OUTPUT_TO_BELA.8
SEQ1
  Top 0.61: OUTPUT_TO_BELA.14 102.87,21.59 102.87,19.05 101.6,17.78 72.39,17.78 71.12,19.05 71.12,96.52 72.39,97.79 87.63,97.79 I/O_FRONTPLATE1.2
SEQ1_OUT
  Bottom 0.61: I/O_FRONTPLATE1.29 124.46,72.39 123.19,71.12 121.92,71.12 120.65,69.85 R7.1
SEQ1_OUT_BELA  (via drill 0.6)
  Top 0.61: VD13.C R7.2 VD14.A v125.73,44.45 | v125.73,12.7 125.73,11.43 124.46,10.16 64.77,10.16 63.5,11.43 63.5,31.75 62.23,33.02 8.89,33.02 7.62,34.29 7.62,54.61 8.89,55.88 27.94,55.88 30.48,53.34 ANALOG_OUT.2 | v125.73,15.24 v125.73,40.64
  Bottom 0.61: v125.73,12.7 v125.73,15.24 | v125.73,40.64 v125.73,44.45
SEQ2  (via drill 0.6)
  Top 0.61: I/O_FRONTPLATE1.4 90.17,95.25 78.74,95.25 77.47,93.98 77.47,22.86 76.2,21.59 v76.2,19.05
  Bottom 0.61: v76.2,19.05 76.2,15.24 77.47,13.97 105.41,13.97 106.68,15.24 OUTPUT_TO_BELA.15
SEQ2_OUT
  Bottom 0.61: I/O_FRONTPLATE1.30 125.73,95.25 125.73,68.58 R8.1
SEQ2_OUT_BELA  (via drill 0.6)
  Top 0.61: VD15.C R8.2 VD16.A | v123.19,12.7 121.92,11.43 66.04,11.43 64.77,12.7 64.77,33.02 63.5,34.29 10.16,34.29 8.89,35.56 8.89,53.34 10.16,54.61 26.67,54.61 27.94,53.34 ANALOG_OUT.3 | v123.19,15.24 123.19,40.64 124.46,41.91 125.73,41.91 127,43.18 v127,46.99 | v127,49.53 v127,55.88
  Bottom 0.61: v123.19,12.7 v123.19,15.24 | v127,46.99 v127,49.53 | v127,55.88 VD16.A
SEQ2_PRESET  (via drill 0.6)
  Top 0.61: v132.08,101.6 v132.08,97.79 | R12.2 25.4,95.7 24.18,94.48 24.18,92.66 P9.13
  Bottom 0.61: v132.08,101.6 132.08,102.87 130.81,104.14 35.56,104.14 29.21,97.79 27.94,97.79 26.67,97.79 R12.2 | v132.08,97.79 132.08,96.52 I/O_FRONTPLATE1.33
SEQ3
  Top 0.61: OUTPUT_TO_BELA.16 105.41,21.59 105.41,17.78 104.14,16.51 71.12,16.51 69.85,17.78 69.85,99.06 71.12,100.33 92.71,100.33 93.98,99.06 I/O_FRONTPLATE1.6
SEQ4
  Top 0.61: OUTPUT_TO_BELA.17 107.95,21.59 107.95,26.67 106.68,27.94 86.36,27.94 85.09,29.21 85.09,73.66 86.36,74.93 97.79,74.93 99.06,76.2 I/O_FRONTPLATE1.9
SEQ5
  Top 0.61: I/O_FRONTPLATE1.11 101.6,74.93 100.33,73.66 87.63,73.66 86.36,72.39 86.36,30.48 87.63,29.21 107.95,29.21 109.22,27.94 OUTPUT_TO_BELA.18
SEQ6
  Top 0.61: I/O_FRONTPLATE1.14 105.41,95.25 105.41,73.66 104.14,72.39 88.9,72.39 87.63,71.12 87.63,31.75 88.9,30.48 109.22,30.48 110.49,29.21 110.49,21.59 OUTPUT_TO_BELA.19
SEQ7
  Top 0.61: I/O_FRONTPLATE1.16 107.95,95.25 107.95,72.39 106.68,71.12 90.17,71.12 88.9,69.85 88.9,33.02 90.17,31.75 110.49,31.75 111.76,30.48 OUTPUT_TO_BELA.20
SEQ8  (via drill 0.6)
  Top 0.61: v100.33,33.02 v104.14,33.02
  Bottom 0.61: I/O_FRONTPLATE1.19 111.76,85.09 110.49,83.82 87.63,83.82 86.36,82.55 86.36,41.91 87.63,40.64 99.06,40.64 100.33,39.37 v100.33,33.02 | v104.14,33.02 111.76,33.02 113.03,31.75 113.03,21.59 OUTPUT_TO_BELA.21
SEQ_GATE
  Bottom 0.61: I/O_FRONTPLATE1.26 120.65,95.25 120.65,76.2 119.38,74.93 110.49,74.93 109.22,73.66 R5.1
SEQ_GATE_BELA  (via drill 0.6)
  Top 0.61: VD9.C R5.2 VD10.A v111.76,55.88 | v111.76,53.34 111.76,49.53 113.03,48.26 v129.54,48.26 | v142.24,48.26 143.51,48.26 144.78,46.99 144.78,15.24 146.05,13.97 | 146.05,13.97 185.42,13.97 186.69,15.24 v186.69,22.86 | 146.05,13.97 v142.24,13.97 | v129.54,13.97 68.58,13.97 67.31,15.24 67.31,35.56 66.04,36.83 21.59,36.83 20.32,38.1 P8.9
  Bottom 0.61: v111.76,55.88 v111.76,53.34 | v186.69,22.86 IC4.14 | v142.24,48.26 v129.54,48.26 | v129.54,13.97 v142.24,13.97
TEMPO
  Bottom 0.61: I/O_FRONTPLATE1.20 113.03,95.25 113.03,83.82 111.76,82.55 88.9,82.55 87.63,81.28 87.63,43.18 88.9,41.91 100.33,41.91 101.6,40.64 OUTPUT_TO_BELA.12
V/OCT
  Bottom 0.61: I/O_FRONTPLATE1.22 115.57,95.25 115.57,81.28 114.3,80.01 95.25,80.01 93.98,78.74 R1.1
V/OCT_BELA
  Top 0.61: VD2.C R1.2 | R1.2 VD1.A | OUTPUT_TO_BELA.22 114.3,35.56 113.03,36.83 95.25,36.83 93.98,38.1 R1.2
VOLUME
  Bottom 0.61: I/O_FRONTPLATE1.21 114.3,82.55 113.03,81.28 90.17,81.28 88.9,80.01 88.9,44.45 90.17,43.18 101.6,43.18 102.87,41.91 102.87,21.59 OUTPUT_TO_BELA.13
VOLUME_A/B  (via drill 0.6)
  Top 0.61: v95.25,99.06 96.52,97.79 I/O_FRONTPLATE1.8
  Bottom 0.61: OUTPUT_TO_BELA.5 93.98,17.78 92.71,16.51 80.01,16.51 78.74,17.78 78.74,97.79 80.01,99.06 v95.25,99.06
WAVEFORM_A  (via drill 0.6)
  Top 0.61: I/O_FRONTPLATE1.31 125.73,95.25 125.73,101.6 124.46,102.87 v22.86,102.87 | R37.2 22.86,95.7 21.64,94.48 21.64,92.66 P9.11
  Bottom 0.61: I/O_FRONTPLATE1.31 128.27,95.25 128.27,97.79 129.54,99.06 191.77,99.06 193.04,97.79 193.04,52.07 191.77,50.8 IC2.14 | v22.86,102.87 R37.2
WAVEFORM_B
  Top 0.61: IC3.14 R10.2
  Bottom 0.61: R10.2 198.12,99.06 196.85,100.33 128.27,100.33 | 128.27,100.33 127,99.06 I/O_FRONTPLATE1.32 | 128.27,100.33 127,101.6 68.58,101.6 66.04,99.06 66.04,86.36 63.5,83.82 43.18,83.82 36.88,77.52 36.88,41.96 35.56,40.64 30.48,40.64 P8.15